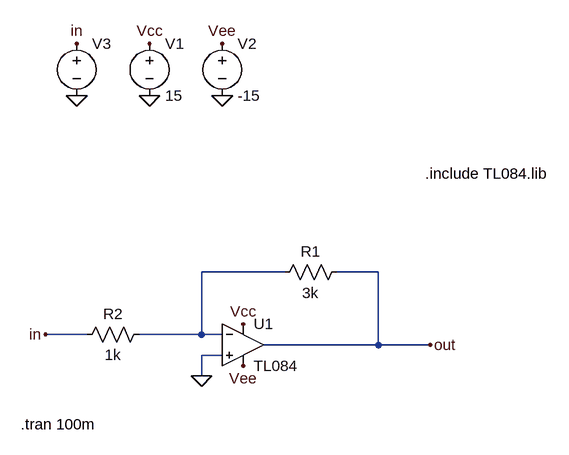
[diagram p0: schematic inverter.asc]
inverter.asc, the LTspice schematic file:
Version 4
SHEET 1 880 680
WIRE 240 64 112 64
WIRE 384 64 320 64
WIRE -64 160 -128 160
WIRE 112 160 112 64
WIRE 112 160 16 160
WIRE 144 160 112 160
WIRE 384 176 384 64
WIRE 384 176 208 176
WIRE 464 176 384 176
WIRE 144 192 112 192
WIRE 112 224 112 192
FLAG 464 176 out
FLAG 112 224 0
FLAG 32 -208 0
FLAG 144 -208 0
FLAG 32 -288 Vcc
FLAG 144 -288 Vee
FLAG -128 160 in
FLAG -80 -208 0
FLAG -80 -288 in
FLAG 176 144 Vcc
FLAG 176 208 Vee
SYMBOL res 336 48 R90
WINDOW 0 0 56 VBottom 2
WINDOW 3 32 56 VTop 2
SYMATTR InstName R1
SYMATTR Value 3k
SYMBOL res 32 144 R90
WINDOW 0 0 56 VBottom 2
WINDOW 3 32 56 VTop 2
SYMATTR InstName R2
SYMATTR Value 1k
SYMBOL voltage 32 -304 R0
WINDOW 123 0 0 Left 0
WINDOW 39 0 0 Left 0
SYMATTR InstName V1
SYMATTR Value 15
SYMBOL voltage 144 -304 R0
WINDOW 123 0 0 Left 0
WINDOW 39 0 0 Left 0
SYMATTR InstName V2
SYMATTR Value -15
SYMBOL voltage -80 -304 R0
WINDOW 3 24 96 Invisible 2
WINDOW 123 0 0 Left 0
WINDOW 39 0 0 Left 0
SYMATTR InstName V3
SYMATTR Value SINE(0 1 1k)
SYMBOL Opamps\\opamp2 176 112 R0
SYMATTR InstName U1
SYMATTR Value TL084
TEXT -166 298 Left 2 !.tran 100m
TEXT 456 -88 Left 2 !.include TL084.lib

The netlist it stands for:
* inverter.asc
R1 out N001 3k
R2 N001 in 1k
V1 Vcc 0 15
V2 Vee 0 -15
V3 in 0 SINE(0 1 1k)
XU1 0 N001 Vcc Vee out TL084  ; pins In+ In- V+ V- OUT
.tran 100m
.include TL084.lib
.backanno
.end